# Altium schematic sheet BG_IO_Programming_Schematic.SchDoc
size A; SheetNumber: 5; SheetTotal: 6
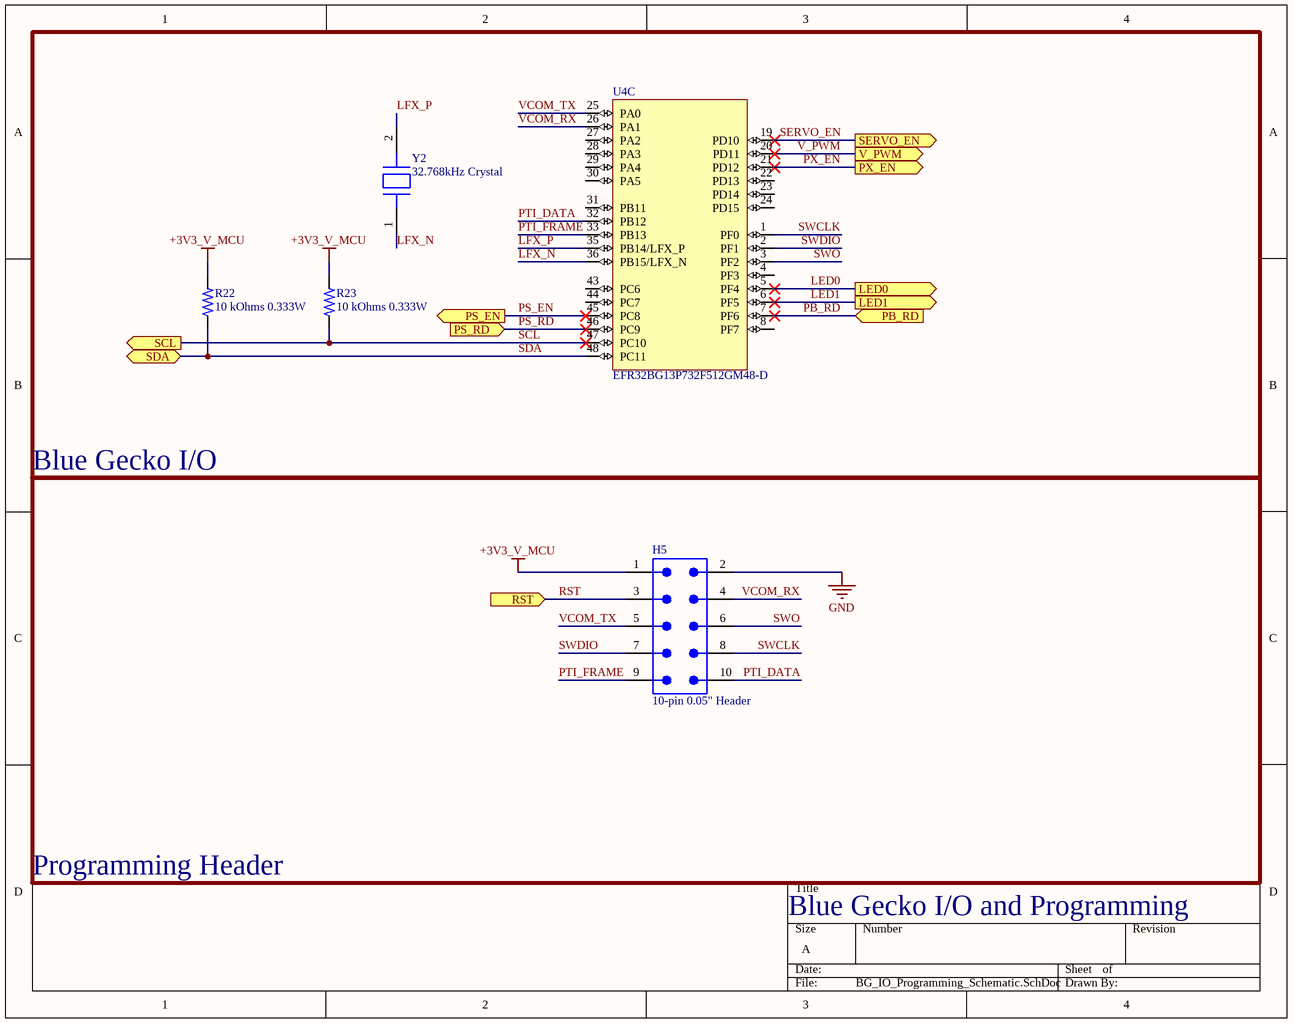
[diagram p0: BG_IO_Programming_Schematic.SchDoc]

## Parts
H5  10-pin 0.05" Header  [FTSH-105-01-XXX-DV-K]
R22  10 kOhms 0.333W  [RESC0603X06N]
R23  10 kOhms 0.333W  [RESC0603X06N]
U4  EFR32BG13P732F512GM48-D  [48-QFN_7x7]  (part C of 3)
Y2  32.768kHz Crystal  [DFN153P160X50-2N]

## Blocks framed on the sheet
Blue Gecko I/O: R22 R23 U4 Y2

## Ports
LED0 (out), LED1 (out), PB_RD (in), PS_EN (out), PS_RD (in), PX_EN (out), RST (in), SCL (out), SDA (bidir), SERVO_EN (out), V_PWM (out)

## Nets
+3V3_V_MCU: H5.1 R22.2 R23.2
GND: H5.2
LED0: U4.5(PF4) ; port LED0
LED1: U4.6(PF5) ; port LED1
LFX_N: U4.36(PB15/LFX_N) Y2.1
LFX_P: U4.35(PB14/LFX_P) Y2.2
PB_RD: U4.7(PF6) ; port PB_RD
PS_EN: U4.45(PC8) ; port PS_EN
PS_RD: U4.46(PC9) ; port PS_RD
PTI_DATA: H5.10 U4.32(PB12)
PTI_FRAME: H5.9 U4.33(PB13)
PX_EN: U4.21(PD12) ; port PX_EN
RST: H5.3 ; port RST
SCL: R23.1 U4.47(PC10) ; port SCL
SDA: R22.1 U4.48(PC11) ; port SDA
SERVO_EN: U4.19(PD10) ; port SERVO_EN
SWCLK: H5.8 U4.1(PF0)
SWDIO: H5.7 U4.2(PF1)
SWO: H5.6 U4.3(PF2)
V_PWM: U4.20(PD11) ; port V_PWM
VCOM_RX: H5.4 U4.26(PA1)
VCOM_TX: H5.5 U4.25(PA0)

Not connected (* = marked no-connect by the designer): U4 4(PF3) 8(PF7) 22(PD13) 23(PD14) 24(PD15) 27(PA2) 28(PA3) 29(PA4) 30(PA5) 31(PB11) 43(PC6) 44(PC7)

## Notes on the sheet
- Programming Header
- Blue Gecko I/O and Programming

## Library data of the parts
H5 = FTSH-105-01-LM-DV-K: Conn Unshrouded Header HDR 10 POS 1.27mm Solder ST Top Entry SMD Tube; Manufacturer: Samtec; Number of Contacts: 10; Gender: Male; Supplier 1: Digi-Key; Manufacturer Part Number: FTSH-105-01-LM-DV-K; RoHS: Yes; Category: Connectors; Stock 1: 11199; Pricing 1: 1=4.62000, 10=4.19500, 92=3.69598, 460=3.14161, 1012=2.67960 (USD); Contact Plating: Gold; Contact Material: Bronze; Housing Color: Black; Housing Material: Polymer; Min Operating Temperature: -55°C; Max Operating Temperature: 125°C; Number of Rows: 2; Termination: Solder; Packaging: Rail/Tube; Orientation: Straight; Length: 6.35mm; Pitch: 1.27mm; Depth: 3.43mm; Radiation Hardening: No; ComponentLink1URL: https://datasheet.ciiva.com/10245/ftsh-mt-10245149.pdf?src-supplier=Avnet; ComponentLink1Description: https://datasheet.ciiva.com/10245/ftsh-mt-10245149.pdf?src-supplier=Avnet; ComponentLink2URL: https://datasheet.ciiva.com/16689/ftsh-mt-16689356.pdf?src-supplier=Avnet+Europe; ComponentLink2Description: https://datasheet.ciiva.com/16689/ftsh-mt-16689356.pdf?src-supplier=Avnet+Europe
R22 R23 = CRCW060310K0FKEAHP: Res Thick Film 0603 10K Ohm 1% 0.33W(1/3W) ±100ppm/°C Pad SMD Automotive T/R; Manufacturer: Vishay; Resistance: 10kR; Power Rating: 250mW; Voltage Rating: 75V; Supplier 1: Digi-Key; Manufacturer Part Number: CRCW060310K0FKEAHP; RoHS: Yes; Category: Chip SMD Resistors; Stock 1: 391663; Pricing 1: 1=0.17000, 10=0.14800, 100=0.05790, 1000=0.02422, 2500=0.02220 (USD); Case/Package: 0603; Contact Plating: Tin; Weight: 7.1E-05oz; Case Code (Metric): 1608; Case Code (Imperial): 0603; Min Operating Temperature: -55°C; Max Operating Temperature: 155°C; Tolerance: 1%; Resistor Type: Thick Film; Temperature Coefficient: 100ppm/°C; Packaging: Tape and Reel; Package Quantity: 10; Number of Terminations: 2; Termination: SMD/SMT; Max Power Dissipation: 250mW; Voltage Rating (DC): 75V; Features: Automotive AEC-Q200; Series: CRCW-HP; Construction: Rectangular; Resistance Tolerance: 1%; Technology: THICK FILM; Length: 1.6mm; Width: 0.033inch; Height: 0.45mm; Depth: 0.85mm; Radiation Hardening: No; REACH SVHC: Unknown; Military Standard: Not; Lead Free: Lead Free; RoHS Compliant: Yes; ComponentLink1URL: https://datasheet.ciiva.com/9052/crcwhpe3-9052617.pdf?src-supplier=Avnet; ComponentLink1Description: https://datasheet.ciiva.com/9052/crcwhpe3-9052617.pdf?src-supplier=Avnet; ComponentLink2URL: https://datasheet.ciiva.com/2472/crcwhpe3-2472532.pdf?src-supplier=Digi-Key; ComponentLink2Description: https://datasheet.ciiva.com/2472/crcwhpe3-2472532.pdf?src-supplier=Digi-Key; ComponentLink3URL: https://datasheet.ciiva.com/2472/crcwhpe3-2472533.pdf?src-supplier=Digi-Key; ComponentLink3Description: https://datasheet.ciiva.com/2472/crcwhpe3-2472533.pdf?src-supplier=Digi-Key; ComponentLink4URL: https://datasheet.ciiva.com/2472/crcwhpe3-2472534.pdf?src-supplier=Digi-Key; ComponentLink4Description: https://datasheet.ciiva.com/2472/crcwhpe3-2472534.pdf?src-supplier=Digi-Key; ComponentLink5URL: https://datasheet.ciiva.com/5548/crcwhpe3-46056-5548143.pdf?src-supplier=Mouser; ComponentLink5Description: https://datasheet.ciiva.com/5548/crcwhpe3-46056-5548143.pdf?src-supplier=Mouser; ComponentLink6URL: https://datasheet.ciiva.com/28588/1912814-28588878.pdf?src-supplier=Element14; ComponentLink6Description: https://datasheet.ciiva.com/28588/1912814-28588878.pdf?src-supplier=Element14
U4 = EFR32BG13P732F512GM48-D: Blue Gecko QFN48 2.4 G 19 dB BLE/Proprietary 512 kB 64 kB(RAM) 31GPIO; Manufacturer: Silicon Labs; Supplier 1: Digi-Key; RoHS: Yes; Category: RF Receivers, Transceivers; Pricing 1: 1=8.42000, 10=7.72000, 25=7.01800, 80=6.31625, 230=5.78987, 440=5.26350, 945=4.78499 (USD); ComponentLink1URL: http://www.farnell.com/datasheets/2813683.pdf?src-supplier=Farnell; ComponentLink1Description: http://www.farnell.com/datasheets/2813683.pdf?src-supplier=Farnell; Supplier Part Number 1: 336-5922-ND; Manufacturer Part Number: EFR32BG13P732F512GM48-D
Y2 = ABS05-32.768KHZ-7-T: CRYSTAL 32.768KHZ 7PF SMD; Manufacturer: Abracon; Supplier 1: Digi-Key; Manufacturer Part Number: ABS05-32.768KHZ-7-T; RoHS: No; Category: Uncategorized; Stock 1: 18000; Pricing 1: 1=1.51000, 10=1.44500, 50=1.41120, 100=1.20960, 500=1.17600, 1000=0.99120 (USD)